# EAGLE design ESC_BOARD (EAGLE 9.1.3)
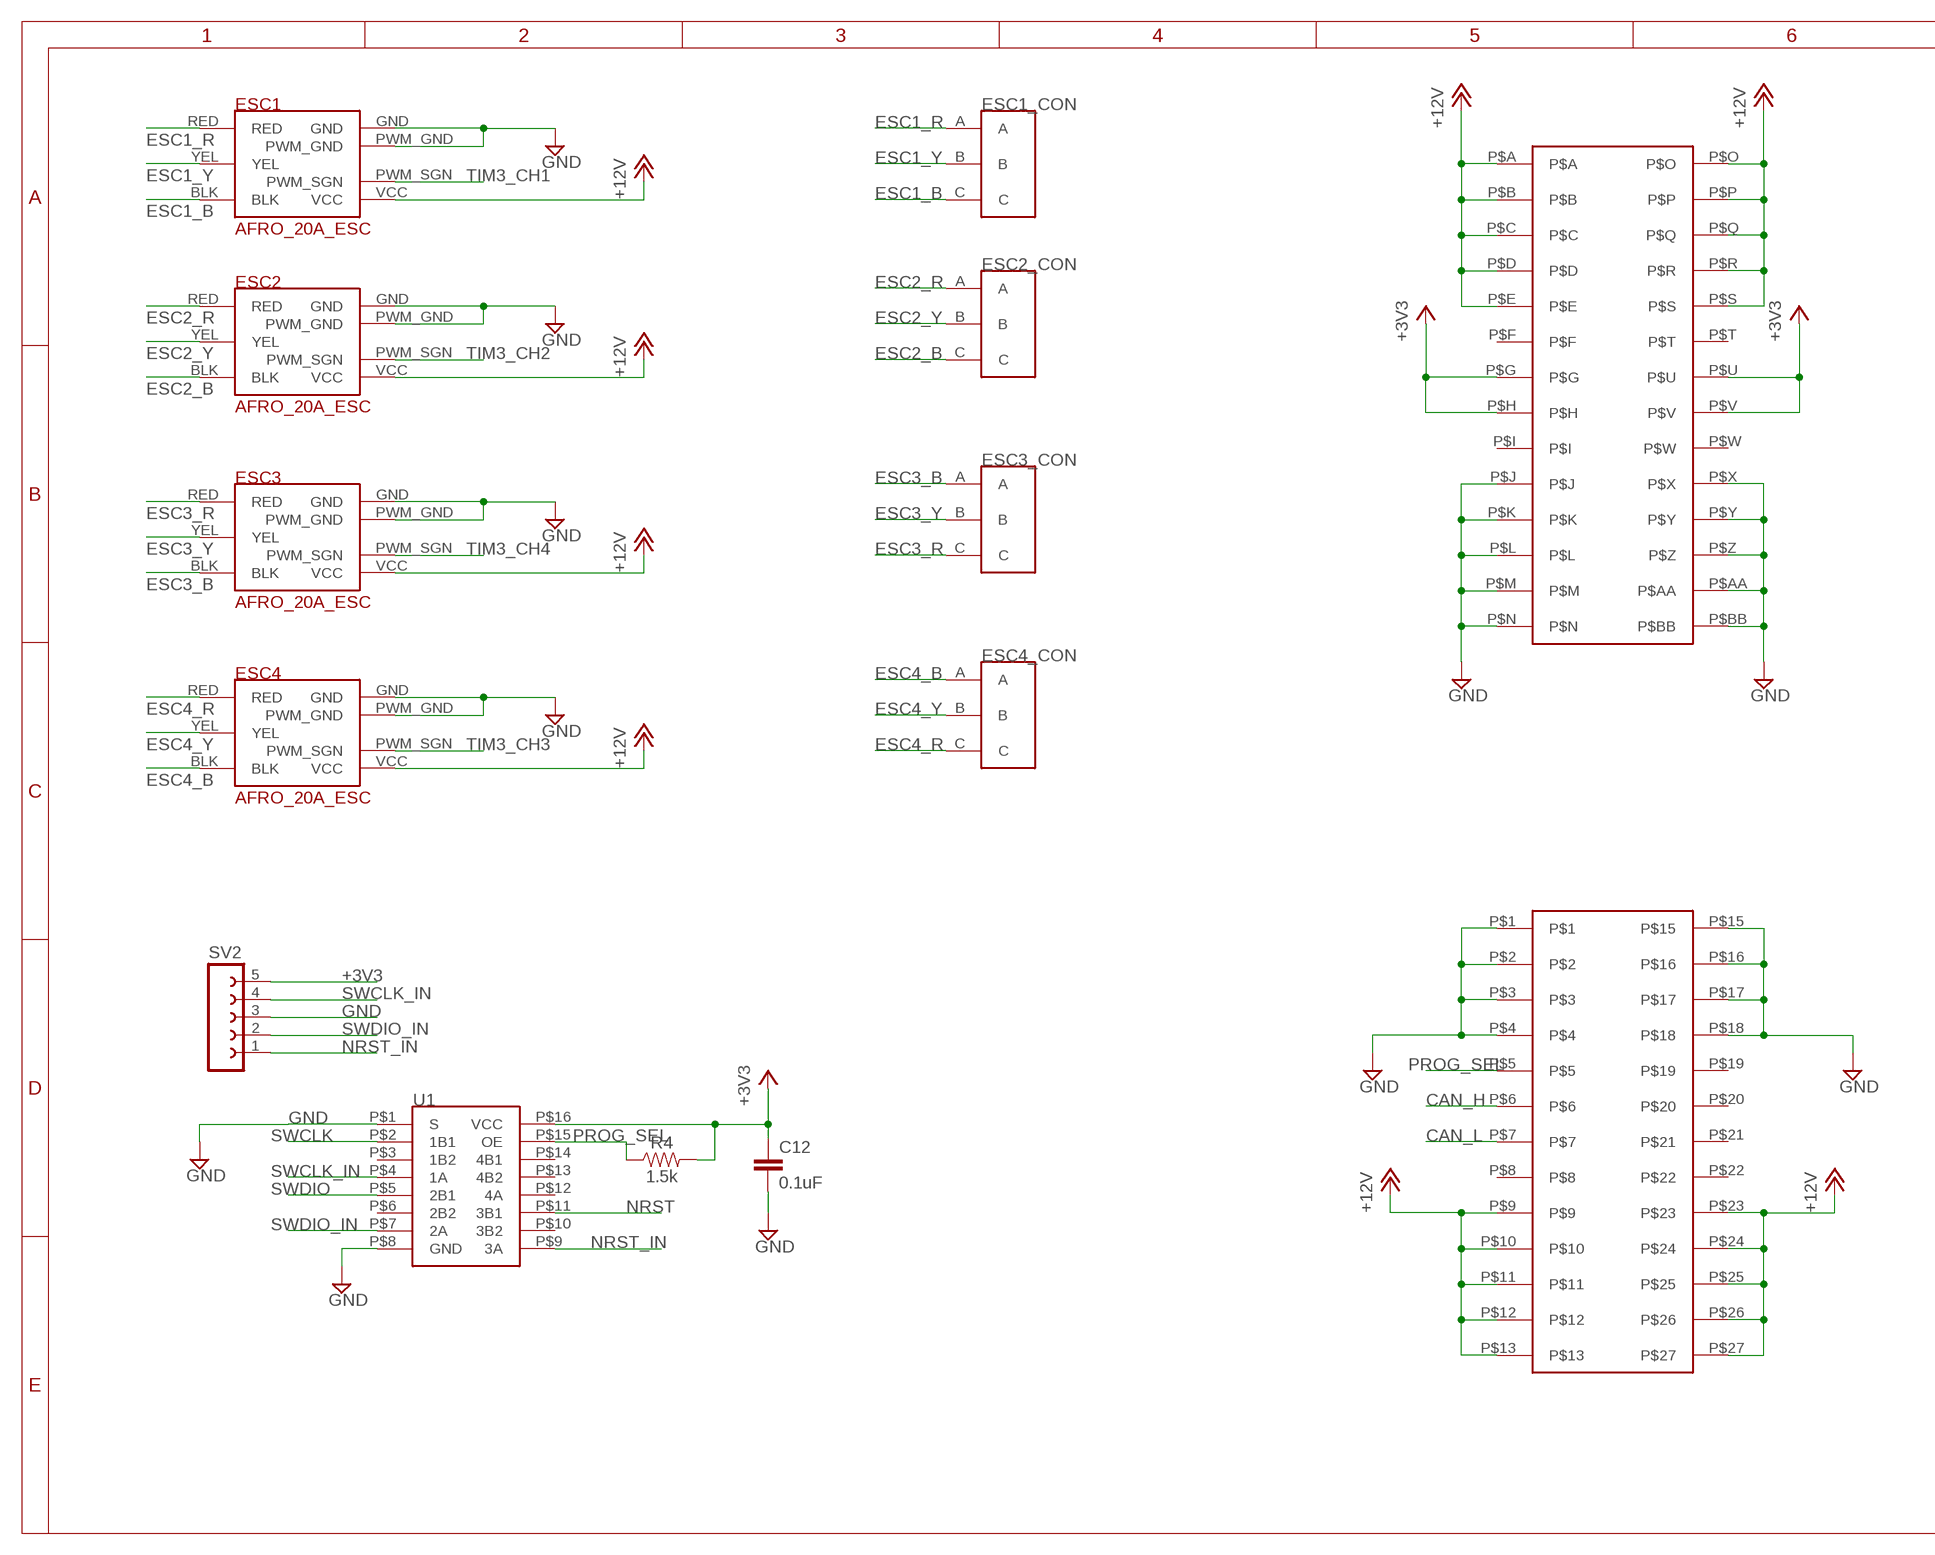
[diagram p0: schematic, sheet 1, part 1 of 2]
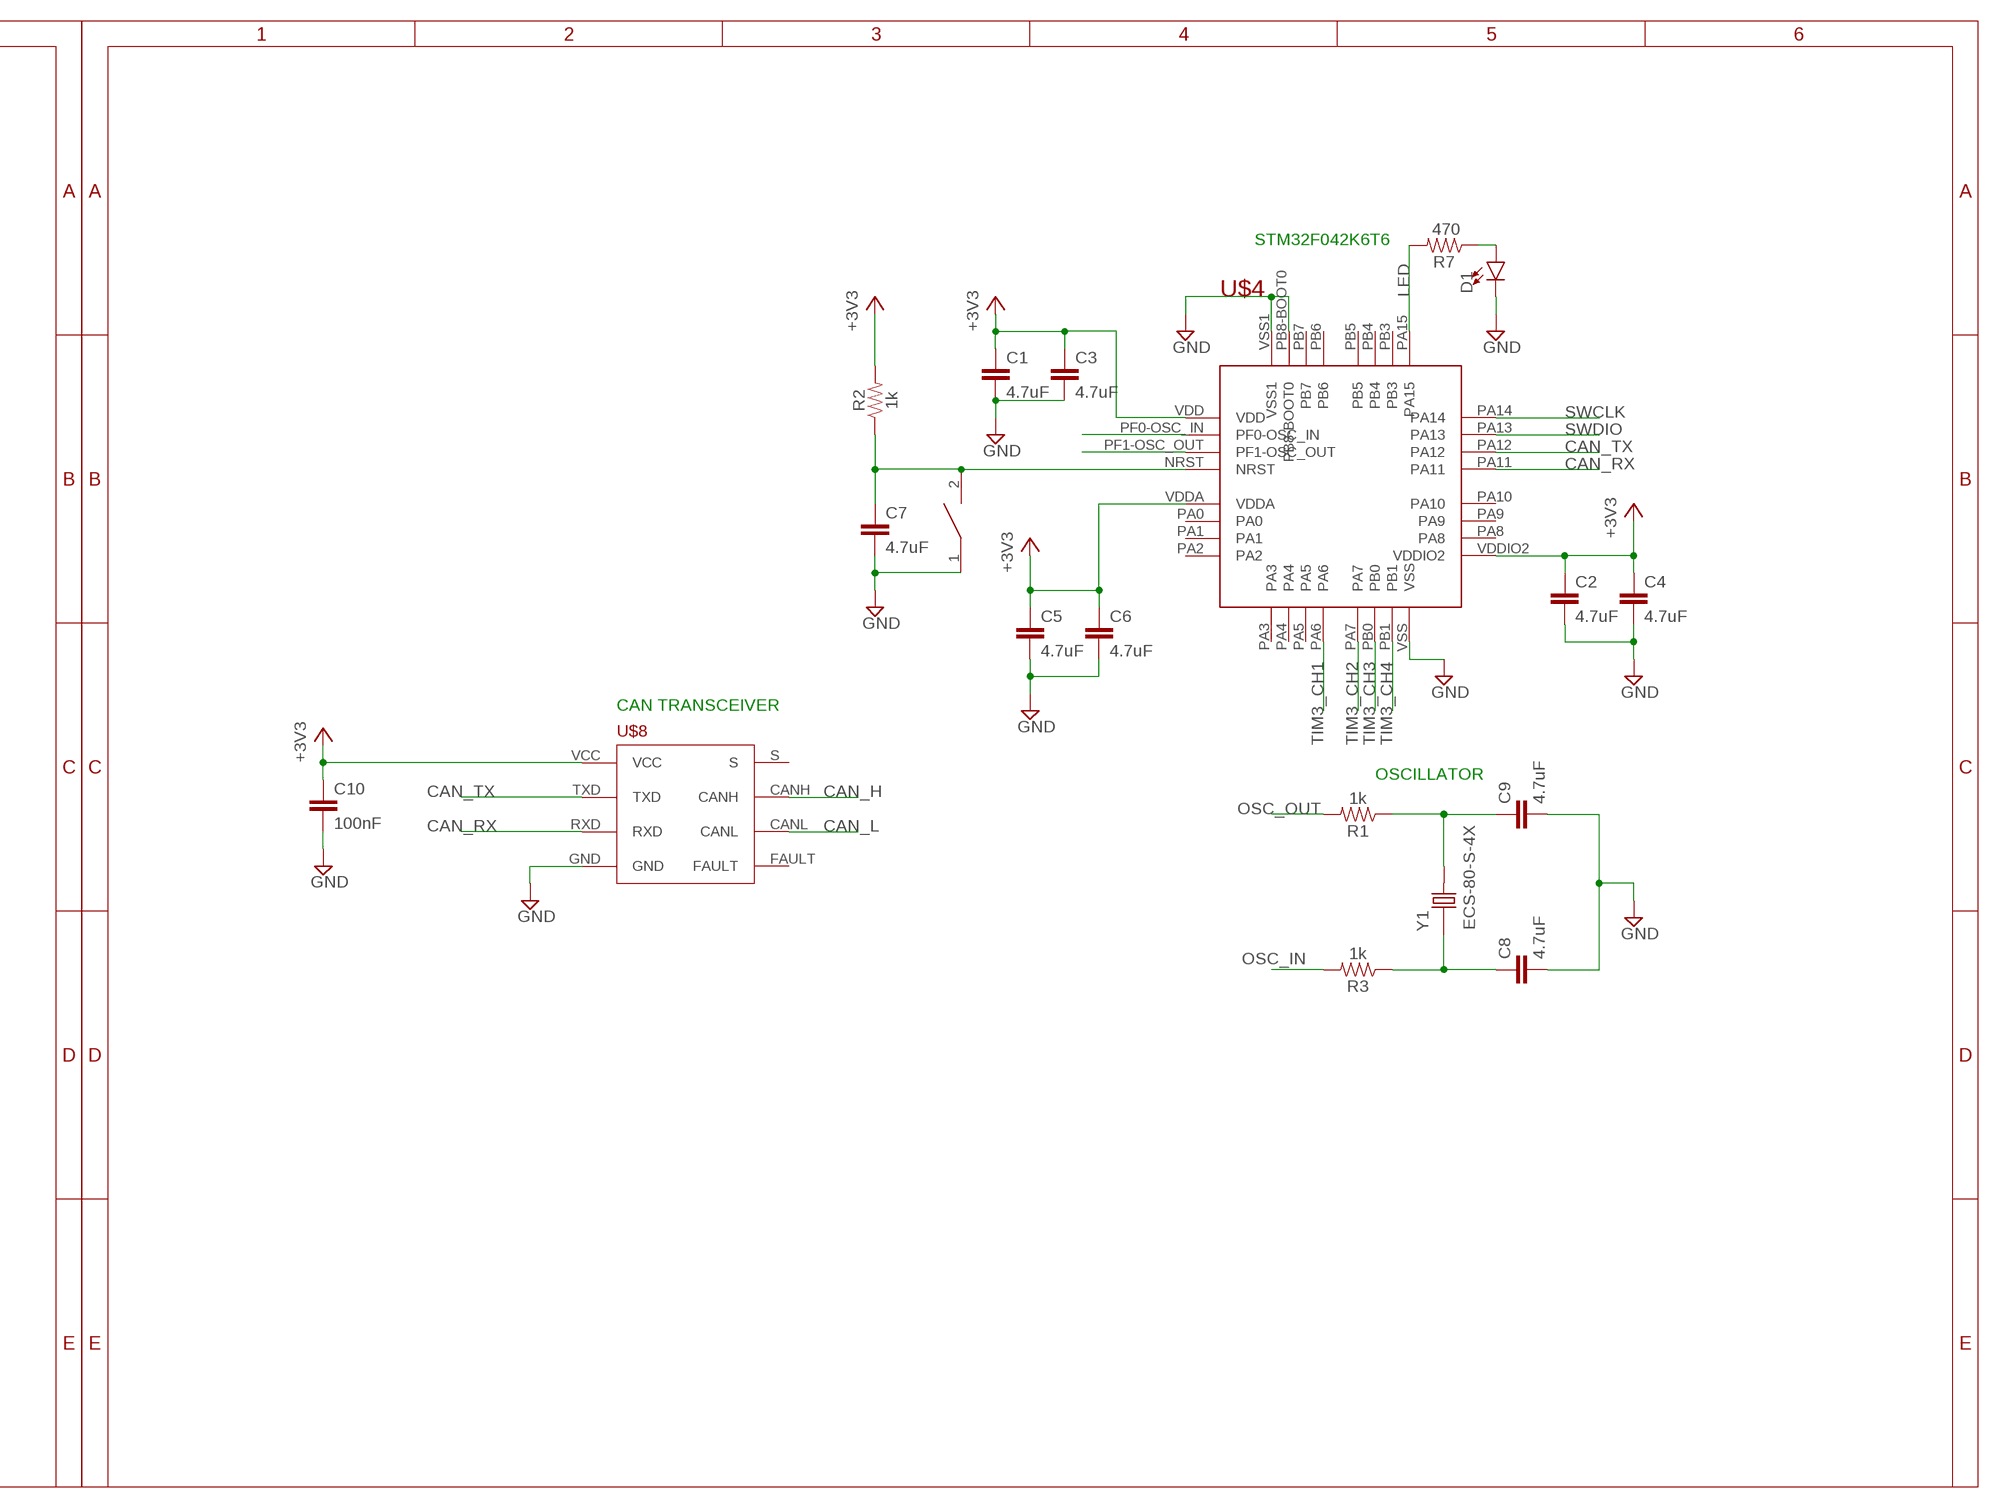
[diagram p1: schematic, sheet 1, part 2 of 2]

## Parts
C1  4.7uF  4.7UF0603  [0603]
C2  4.7uF  4.7UF0603  [0603]
C3  4.7uF  4.7UF0603  [0603]
C4  4.7uF  4.7UF0603  [0603]
C5  4.7uF  4.7UF0603  [0603]
C6  4.7uF  4.7UF0603  [0603]
C7  4.7uF  4.7UF0603  [0603]
C8  4.7uF  4.7UF0603  [0603]
C9  4.7uF  4.7UF0603  [0603]
C10  100nF  4.7UF0603  [0603]
C12  0.1uF  0.1UF-0603-25V-(+80/-20%)  [0603]
D1  LED0603  [LED-0603]
ESC1  AFRO_20A_ESC  [AFRO_20A_ESC]
ESC1_CON  3PINCONNECTOR  [3PINCONNECTOR]
ESC2  AFRO_20A_ESC  [AFRO_20A_ESC]
ESC2_CON  3PINCONNECTOR  [3PINCONNECTOR]
ESC3  AFRO_20A_ESC  [AFRO_20A_ESC]
ESC3_CON  3PINCONNECTOR  [3PINCONNECTOR]
ESC4  AFRO_20A_ESC  [AFRO_20A_ESC]
ESC4_CON  3PINCONNECTOR  [3PINCONNECTOR]
R1  1k  1KOHM-0603-1/10W-1%  [0603]
R2  1k  1KOHM-0603-1/10W-1%  [0603]
R3  1k  1KOHM-0603-1/10W-1%  [0603]
R4  1.5k  1.5KOHM-0603-1/10W-1%  [0603]
R7  470  RESISTOR0603  [0603]
RESET  SWITCH  [SW_2512]
SV2  FE05-1  [FE05-1]
U1  SN74CBTLV3257PWR  [SN74CBTLV3257PWR]
U$1  ESC2BACKPLANE  [ESC2BACKPLANE_WHOLE]
U$4  STM32F042K6T6  [STM32F042K6T6]
U$8  TCAN337D  [TCAN337D]
Y1  ECS-80-S-4X  [XTAL_ECS-80-S-4X]

## Nets
+3V3: C1.1 C2.1 C3.1 C4.1 C5.1 C6.1 C10.1 C12.1 R2.2 R4.2 SV2.5 U1.P$16(VCC) U$1.P$G U$1.P$H U$1.P$U U$1.P$V U$4.VDD U$4.VDDA U$4.VDDIO2 U$8.VCC
+12V: ESC1.VCC ESC2.VCC ESC3.VCC ESC4.VCC U$1.P$9 U$1.P$10 U$1.P$11 U$1.P$12 U$1.P$13 U$1.P$23 U$1.P$24 U$1.P$25 U$1.P$26 U$1.P$27 U$1.P$A U$1.P$B U$1.P$C U$1.P$D U$1.P$E U$1.P$O U$1.P$P U$1.P$Q U$1.P$R U$1.P$S
CAN_H: U$1.P$6 U$8.CANH
CAN_L: U$1.P$7 U$8.CANL
CAN_RX: U$4.PA11 U$8.RXD
CAN_TX: U$4.PA12 U$8.TXD
ESC1_B: ESC1.BLK ESC1_CON.C
ESC1_R: ESC1.RED ESC1_CON.A
ESC1_Y: ESC1.YEL ESC1_CON.B
ESC2_B: ESC2.BLK ESC2_CON.C
ESC2_R: ESC2.RED ESC2_CON.A
ESC2_Y: ESC2.YEL ESC2_CON.B
ESC3_B: ESC3.BLK ESC3_CON.A
ESC3_R: ESC3.RED ESC3_CON.C
ESC3_Y: ESC3.YEL ESC3_CON.B
ESC4_B: ESC4.BLK ESC4_CON.A
ESC4_R: ESC4.RED ESC4_CON.C
ESC4_Y: ESC4.YEL ESC4_CON.B
GND: C1.2 C2.2 C3.2 C4.2 C5.2 C6.2 C7.2 C8.2 C9.2 C10.2 C12.2 D1.C ESC1.GND ESC1.PWM_GND ESC2.GND ESC2.PWM_GND ESC3.GND ESC3.PWM_GND ESC4.GND ESC4.PWM_GND RESET.1 SV2.3 U1.P$1(S) U1.P$8(GND) U$1.P$1 U$1.P$2 U$1.P$3 U$1.P$4 U$1.P$15 U$1.P$16 U$1.P$17 U$1.P$18 U$1.P$AA U$1.P$BB U$1.P$J U$1.P$K U$1.P$L U$1.P$M U$1.P$N U$1.P$X U$1.P$Y U$1.P$Z U$4.PB8-BOOT0 U$4.VSS U$4.VSS1 U$8.GND
LED: R7.2 U$4.PA15
N$1: C9.1 R1.1 Y1.2
N$2: C8.1 R3.1 Y1.1
N$24: D1.A R7.1
NRST: C7.1 R2.1 RESET.2 U1.P$11(3B1) U$4.NRST
NRST_IN: SV2.1 U1.P$9(3A)
OSC_IN: R3.2 U$4.PF0-OSC_IN
OSC_OUT: R1.2 U$4.PF1-OSC_OUT
PROG_SEL: R4.1 U1.P$15(OE) U$1.P$5
SWCLK: U1.P$2(1B1) U$4.PA14
SWCLK_IN: SV2.4 U1.P$4(1A)
SWDIO: U1.P$5(2B1) U$4.PA13
SWDIO_IN: SV2.2 U1.P$7(2A)
TIM3_CH1: ESC1.PWM_SGN U$4.PA6
TIM3_CH2: ESC2.PWM_SGN U$4.PA7
TIM3_CH3: ESC4.PWM_SGN U$4.PB0
TIM3_CH4: ESC3.PWM_SGN U$4.PB1
Unconnected: U1.P$3(1B2) U1.P$6(2B2) U1.P$10(3B2) U1.P$12(4A) U1.P$13(4B2) U1.P$14(4B1) U$1.P$8 U$1.P$19 U$1.P$20 U$1.P$21 U$1.P$22 U$1.P$F U$1.P$I U$1.P$T U$1.P$W U$4.PA0 U$4.PA1 U$4.PA2 U$4.PA3 U$4.PA4 U$4.PA5 U$4.PA8 U$4.PA9 U$4.PA10 U$4.PB3 U$4.PB4 U$4.PB5 U$4.PB6 U$4.PB7 U$8.FAULT U$8.S

## Notes on the sheet
- STM32F042K6T6
- CAN TRANSCEIVER
- OSCILLATOR

## Library data of the parts
C1-C9 = SparkFun-Capacitors:4.7UF: 4.7µF ceramic capacitors A capacitor is a passive two-terminal electrical component used to store electrical energy temporarily in an electric field.; PROD_ID: CAP-08280
C10 = SparkFun-Capacitors:4.7UF: 4.7µF ceramic capacitors A capacitor is a passive two-terminal electrical component used to store electrical energy temporarily in an electric field.; PROD_ID: CAP-08280; VALUE: 4.7uF
C12 = SparkFun-Capacitors:0.1UF: 0.1µF ceramic capacitors A capacitor is a passive two-terminal electrical component used to store electrical energy temporarily in an electric field.; PROD_ID: CAP-00810
D1 = SparkFun-LED:LED: LED (Generic) Standard schematic elements and footprints for 5mm, 3mm, 1206, and 0603 sized LEDs. Generic LEDs with no color specified.
ESC1-ESC4 = afro_20A_esc:AFRO_20A_ESC
ESC1_CON ESC2_CON ESC3_CON ESC4_CON = afro_20A_esc:3PINCONNECTOR
R1-R3 = SparkFun-Resistors:1KOHM: 1kΩ resistor A resistor is a passive two-terminal electrical component that implements electrical resistance as a circuit element. Resistors act to reduce current flow, and, at the same time, act to lower voltage levels within circuits. - Wikipedia; PROD_ID: RES-07856
R4 = SparkFun-Resistors:1.5KOHM: 1.5kΩ resistor A resistor is a passive two-terminal electrical component that implements electrical resistance as a circuit element. Resistors act to reduce current flow, and, at the same time, act to lower voltage levels within circuits. - Wikipedia; PROD_ID: RES-08306
R7 = SparkFun-Resistors:RESISTOR: Generic Resistor Package
RESET = DiscreteComponents:SWITCH
SV2 = con-lsta:FE05-1: FEMALE HEADER; OC_FARNELL: unknown; OC_NEWARK: unknown
U1 = SN74CBTLV3257PWR:SN74CBTLV3257PWR
U$1 = ESC_to_Backplane_Connectors:ESC2BACKPLANE
U$4 = PI_Shield_Library:STM32F042K6T6
U$8 = PI_Shield_Library:TCAN337D
Y1 = ECS-80-S-4X:ECS-80-S-4X: CRYSTAL T/H; DESCRIPTION: Crystal 8MHz Series 2-Pin HC-49/U; DIGI-KEY_PART_NUMBER: X1057-ND; DIGI-KEY_PURCHASE_URL: https://www.digikey.com/product-detail/en/ecs-inc/ECS-80-S-4X/X1057-ND/827549?utm_source=snapeda&utm_medium=aggregator&utm_campaign=symbol; MF: ECS International; MP: ECS-80-S-4X; PACKAGE: HC-49/US ECS International

## Board
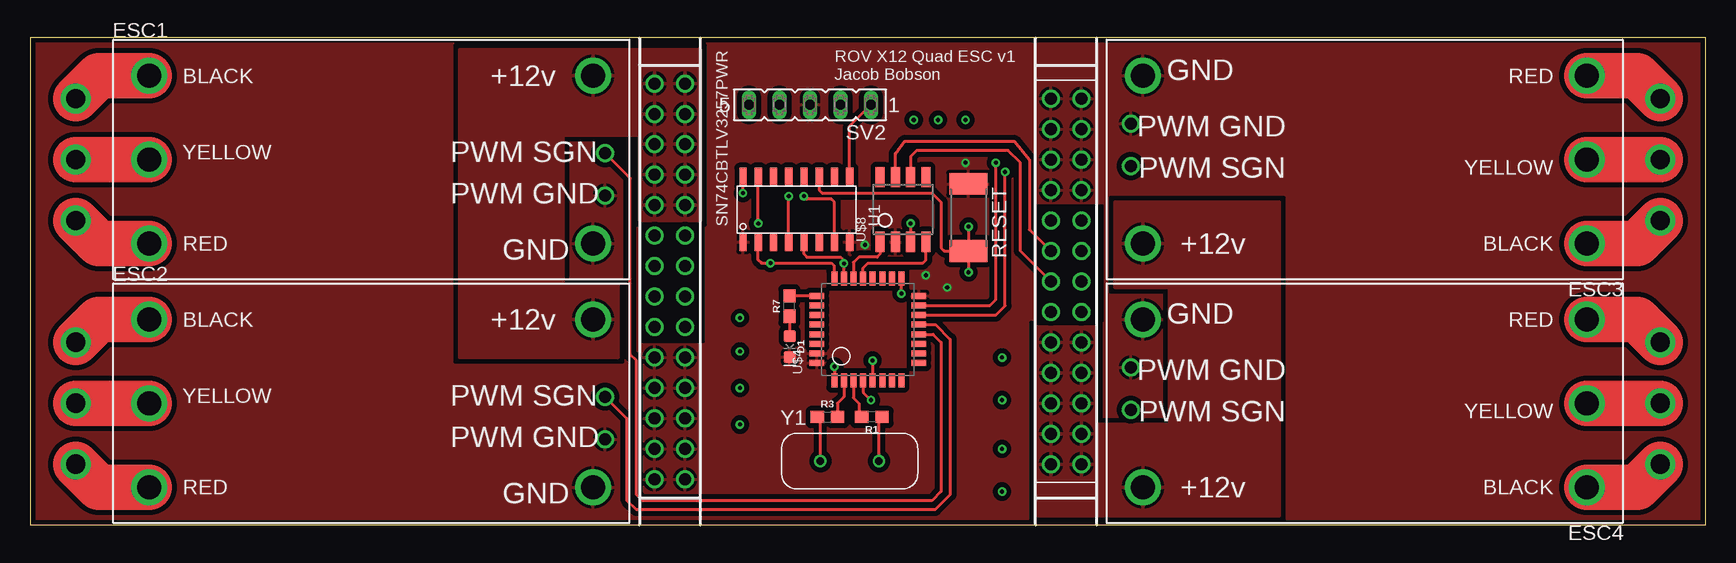
[diagram p2: board, top side]
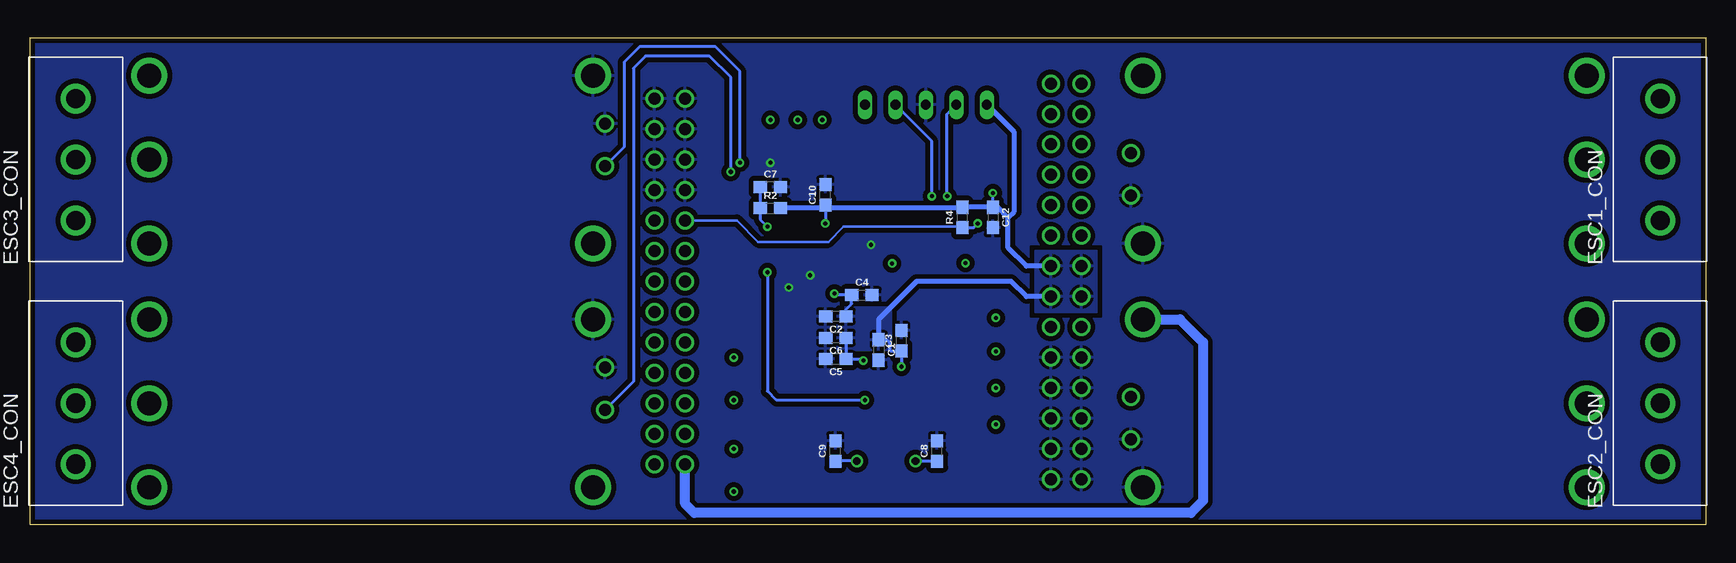
[diagram p3: board, bottom side, seen from below]

Size 139.68 x 40.64 mm. Coordinates in mm from the lower left corner, seen from the top.
Outline: 0,0 139.68,0 139.68,40.64 0,40.64 0,0
Copper layers (1*16): Top 0.0356mm / dielectric 1.5011mm / Bottom 0.0356mm
Design rules "ECE_Senior_Design": minimum track width 8mil, minimum drill 13mil, track to track 8mil, track to pad 8mil, pad to pad 6mil, via to via 8mil, smd to smd 6mil, copper to edge 15mil, drill to drill 8mil, minimum pad ring 7mil, minimum via ring 7mil, stop-mask expansion 3mil, vias tented up to drill 0mil, thermal gap 10mil

### Footprints (pad centres in the part's own frame; a part is rotated, then mirrored left to right if it is on the bottom)
0603 = smd 1.1 x 1: 1 -0.85,0; 2 0.85,0
LED-0603 = smd 1 x 1: A -0.877,0; C 0.877,0
AFRO_20A_ESC = drill 2: BLK -18,7; GND 19,-7; RED -18,-7; VCC 19,7; YEL -18,0 | drill 1: PWM_GND 20,-3; PWM_SGN 20,0.54
3PINCONNECTOR = drill 1.6 pad 2.5: A -5.08,0; B 0,0; C 5.08,0
SW_2512 = smd 1.8 x 3.2: 1 -2.8,0; 2 2.8,0
FE05-1 = drill 0.813 long: 1 -5.08,0; 2 -2.54,0; 3 0,0; 4 2.54,0; 5 5.08,0
SN74CBTLV3257PWR = smd 1.55 x 0.6: P$1 0,0; P$2 0,-1.27; P$3 0,-2.54; P$4 0,-3.81; P$5 0,-5.08; P$6 0,-6.35; P$7 0,-7.62; P$8 0,-8.89; P$9 5.4,-8.89; P$10 5.4,-7.62; P$11 5.4,-6.35; P$12 5.4,-5.08; P$13 5.4,-3.81; P$14 5.4,-2.54; P$15 5.4,-1.27; P$16 5.4,0
ESC2BACKPLANE_WHOLE = drill 1: P$1 1.27,31.75; P$2 3.81,31.75; P$3 6.35,31.75; P$4 8.89,31.75; P$5 11.43,31.75; P$6 13.97,31.75; P$7 16.51,31.75; P$8 19.05,31.75; P$9 21.59,31.75; P$10 24.13,31.75; P$11 26.67,31.75; P$12 29.21,31.75; P$13 31.75,31.75; P$15 1.27,34.29; P$16 3.81,34.29; P$17 6.35,34.29; P$18 8.89,34.29; P$19 11.43,34.29; P$20 13.97,34.29; P$21 16.51,34.29; P$22 19.05,34.29; P$23 21.59,34.29; P$24 24.13,34.29; P$25 26.67,34.29; P$26 29.21,34.29; P$27 31.75,34.29; P$A 0,-1.27; P$AA 30.48,1.27; P$B 2.54,-1.27; P$BB 33.02,1.27; P$C 5.08,-1.27; P$D 7.62,-1.27; P$E 10.16,-1.27; P$F 12.7,-1.27; P$G 15.24,-1.27; P$H 17.78,-1.27; P$I 20.32,-1.27; P$J 22.86,-1.27; P$K 25.4,-1.27; P$L 27.94,-1.27; P$M 30.48,-1.27; P$N 33.02,-1.27; P$O 0,1.27; P$P 2.54,1.27; P$Q 5.08,1.27; P$R 7.62,1.27; P$S 10.16,1.27; P$T 12.7,1.27; P$U 15.24,1.27; P$V 17.78,1.27; P$W 20.32,1.27; P$X 22.86,1.27; P$Y 25.4,1.27; P$Z 27.94,1.27
STM32F042K6T6 = smd 1.2 x 0.5: NRST 0,3.2; PA0 0,1.6; PA1 0,0.8; PA2 0,0; PA8 8.5,0.8; PA9 8.5,1.6; PA10 8.5,2.4; PA11 8.5,3.2; PA12 8.5,4; PA13 8.5,4.8; PA14 8.5,5.6; PF0-OSC_IN 0,4.8; PF1-OSC_OUT 0,4; VDD 0,5.6; VDDA 0,2.4; VDDIO2 8.5,0 | smd 0.5 x 1.2: PA3 1.45,-1.45; PA4 2.25,-1.45; PA5 3.05,-1.45; PA6 3.85,-1.45; PA7 4.65,-1.45; PA15 7.05,7.05; PB0 5.45,-1.45; PB1 6.25,-1.45; PB3 6.25,7.05; PB4 5.45,7.05; PB5 4.65,7.05; PB6 3.85,7.05; PB7 3.05,7.05; PB8-BOOT0 2.25,7.05; VSS 7.05,-1.45; VSS1 1.45,7.05
TCAN337D = smd 1.7 x 0.75: CANH 5.4,2.54; CANL 5.4,1.27; FAULT 5.4,0; GND 0,2.54; RXD 0,0; S 5.4,3.81; TXD 0,3.81; VCC 0,1.27
XTAL_ECS-80-S-4X = drill 0.63 pad 1.03: 1 -2.44,0; 2 2.44,0

### Placement (x,y rotation side)
C1  68.96,14.61 270 bottom
C2  72.52,17.4 180 bottom
C3  67.06,15.37 90 bottom
C4  70.36,19.18 0 bottom
C5  72.52,13.84 180 bottom
C6  72.52,15.62 180 bottom
C7  77.98,28.19 0 bottom
C8  64.08,6.17 90 bottom
C9  72.57,6.17 90 bottom
C10  73.41,27.53 90 bottom
C12  59.44,25.65 270 bottom
D1  63.32,14.88 270 top
ESC1  27.94,30.48 0 top
ESC1_CON  3.81,30.48 90 bottom
ESC2  27.94,10.16 0 top
ESC2_CON  3.81,10.16 90 bottom
ESC3  111.76,30.48 180 top
ESC3_CON  135.89,30.48 90 bottom
ESC4  111.76,10.16 180 top
ESC4_CON  135.89,10.16 90 bottom
R1  70.18,9.02 180 top
R2  77.98,26.42 0 bottom
R3  66.47,9.02 0 top
R4  61.98,25.65 90 bottom
R7  63.3,18.26 90 top
RESET  78.23,25.65 270 top
SV2  65.02,35.05 180 top
U1  59.44,23.62 90 top
U$1  53.34,36.83 270 top
U$4  72.64,12.06 90 top
U$8  74.68,23.62 90 top
Y1  68.33,5.33 0 top

### Tracks (layer width: path | path; a pad name or v marks a point on that pad's centre or on a via)
+3V3  (via drill 0.35)
  Top 0.254: v72.64,19.3 U$4.VDDIO2 | v67.06,13.21 67.06,12.08 U$4.VDD | v70.23,13.72 70.24,13.7 U$4.VDDA | v59.44,27.69 U1.P$16 | v73.41,25.15 U$8.VCC
  Bottom 0.254: v72.64,19.3 72.52,19.18 C4.1 71.21,18.45 71.67,18 C2.1 | v67.06,13.21 C3.1 67.91,14.52 67.94,14.48 68.07,14.61 68.07,15.24 68.29,15.46 C1.1 | v70.23,13.72 70.36,13.84 C5.1 C6.1 | C12.1 v59.44,27.69 | C10.1 73.41,26.42 v73.41,25.15
  Bottom 0.406: U$1.P$U 56.64,21.59 58.17,23.11 58.17,25.65 | 58.17,25.65 59.02,26.5 C12.1 R4.2 62.06,26.42 73.41,26.42 | 58.17,25.65 57.66,26.16 57.66,32.77 SV2.5 | C10.1 73.67,26.42 R2.2 | C1.1 68.96,17.14 65.79,20.32 57.91,20.32 56.64,19.05 U$1.P$V
  pour Bottom: 72.39,18.16 72.39,14.61 67.94,14.61 67.94,18.16
  pour Bottom: 50.8,22.86 55.88,22.86 55.88,17.78 50.8,17.78
+12V
  Bottom 0.813: ESC2.VCC 43.83,17.16 41.91,15.24 41.91,2.03 42.93,1.02 84.33,1.02 85.09,1.78 U$1.P$13
  pour Top (isolate 0.406, rank 2): 55.88,25.4 50.8,25.4 50.8,38.35 55.88,38.35
  pour Top (isolate 0.406, rank 2): 83.82,3.56 83.82,16.51 88.9,16.51 88.9,3.56
  pour Top (isolate 0.406, rank 2): 43.43,39.62 43.43,32.51 55.88,32.51 55.88,39.62
  pour Top (isolate 0.406, rank 2): 44.45,39.62 35.81,39.62 35.81,13.97 49.02,13.97 49.02,20.07 44.45,20.07
  pour Top (isolate 0.406, rank 2): 83.82,8.38 83.82,0.76 104.14,0.76 104.14,8.38
  pour Top (isolate 0.406, rank 2): 104.14,8.38 104.14,26.92 90.42,26.92 90.42,19.81 95,19.81 95,8.38
CAN_H
  Top 0.254: U$8.CANH 72.14,30.99 72.9,32 82.04,32 83.31,30.48 83.31,24.64 U$1.P$6
CAN_L
  Top 0.254: U$1.P$7 82.55,22.86 82.55,30.23 81.53,31.24 73.91,31.24 73.41,30.73 U$8.CANL
CAN_RX
  Top 0.254: U$4.PA11 69.44,21.44 69.85,21.84 74.42,21.84 74.68,22.1 U$8.RXD
CAN_TX
  Top 0.254: U$8.TXD 70.87,22.61 70.61,22.35 69.09,22.35 68.64,21.91 U$4.PA12
ESC1_B
  Top 3.81: ESC1_CON.C 5.73,37.48 ESC1.BLK
ESC1_R
  Top 3.81: ESC1_CON.A 5.73,23.48 ESC1.RED
ESC1_Y
  Top 3.81: ESC1_CON.B ESC1.YEL
ESC2_B
  Top 3.81: ESC2.BLK 5.73,17.16 ESC2_CON.C
ESC2_R
  Top 3.81: ESC2.RED 5.73,3.16 ESC2_CON.A
ESC2_Y
  Top 3.81: ESC2.YEL ESC2_CON.B
ESC3_B
  Top 3.81: ESC3.BLK 133.97,23.48 ESC3_CON.A
ESC3_R
  Top 3.81: ESC3.RED 133.97,37.48 ESC3_CON.C
ESC3_Y
  Top 3.81: ESC3.YEL ESC3_CON.B
ESC4_B
  Top 3.81: ESC4.BLK 133.97,3.16 ESC4_CON.A
ESC4_R
  Top 3.81: ESC4.RED 133.97,17.16 ESC4_CON.C
ESC4_Y
  Top 3.81: ESC4.YEL ESC4_CON.B
GND  (via drill 0.35)
  other vias: 77.98,30.23 74.68,20.83 76.45,19.81 69.6,23.37
  pour Top (isolate 0.406, rank 3): -1.52,42.16 -1.52,-1.02 141.22,-1.02 141.22,42.16
  pour Bottom (isolate 0.406, rank 3): -0.51,41.66 -0.51,-1.52 142.24,-1.52 142.24,41.66
  cutout Top: 50.8,24.89 56.13,24.89 56.13,15.24 50.8,15.24
  cutout Top: 83.82,26.67 89.41,26.67 89.41,17.02 83.82,17.02
GND1  (via drill 0.35)
  other vias: 73.66,33.78
GND2  (via drill 0.35)
  other vias: 77.98,33.78
GND3  (via drill 0.35)
  other vias: 75.69,33.78
GND4  (via drill 0.35)
  other vias: 59.18,17.27
GND5  (via drill 0.35)
  other vias: 59.18,14.48
GND6  (via drill 0.35)
  other vias: 59.18,11.43
GND7  (via drill 0.35)
  other vias: 59.18,8.38
GND8  (via drill 0.35)
  other vias: 81.03,13.97
GND9  (via drill 0.35)
  other vias: 81.03,10.41
GND10  (via drill 0.35)
  other vias: 81.03,6.35
GND11  (via drill 0.35)
  other vias: 81.03,2.79
LED
  Top 0.254: U$4.PA15 R7.2
N$1
  Top 0.254: Y1.2 70.77,8.75 R1.1
  Bottom 0.254: Y1.2 72.56,5.33 C9.1
N$2
  Top 0.254: Y1.1 65.89,8.75 R3.1
  Bottom 0.254: C8.1 65.87,5.32 Y1.1
N$24
  Top 0.254: R7.1 63.3,15.79 D1.A
NRST  (via drill 0.35)
  Top 0.254: v78.23,24.89 RESET.2 | RESET.2 v78.23,21.08 | U1.P$11 65.79,27.94 66.04,27.69 75.18,27.69 75.95,26.92 75.95,23.11 76.2,22.86 RESET.2 | U$4.NRST 69.44,11.07 v70.1,10.41
  Bottom 0.254: C7.1 R2.1 78.83,25.49 v78.23,24.89 | v78.23,21.08 78.23,11.18 77.47,10.41 v70.1,10.41
NRST_IN
  Top 0.254: U1.P$9 68.33,33.27 SV2.1
OSC_IN
  Top 0.254: U$4.PF0-OSC_IN 67.84,10.69 67.31,10.16 R3.2
OSC_OUT
  Top 0.254: U$4.PF1-OSC_OUT 68.64,10.6 69.09,10.16 69.09,9.26 R1.2
PROG_SEL  (via drill 0.35)
  Top 0.254: v60.71,25.15 U1.P$15
  Bottom 0.203: U$1.P$5 80.77,25.4 78.99,23.62 73.15,23.62 71.88,24.89 62.06,24.89 R4.1
  Bottom 0.254: R4.1 61.05,24.8 v60.71,25.15
SWCLK  (via drill 0.35)
  Top 0.254: U$4.PA14 67.04,21.6 66.8,21.84 v61.72,21.84 60.96,21.84 60.71,22.1 U1.P$2
SWCLK_IN  (via drill 0.35)
  Top 0.254: U1.P$4 v63.25,27.43
  Bottom 0.254: v63.25,27.43 63.25,34.29 SV2.4
SWDIO  (via drill 0.35)
  Top 0.254: U$4.PA13 v67.84,21.82 67.84,22.07 67.56,22.35 64.77,22.35 64.52,22.61 U1.P$5
SWDIO_IN  (via drill 0.35)
  Top 0.254: U1.P$7 67.06,26.92 66.8,27.18 64.77,27.18 v64.52,27.43
  Bottom 0.254: v64.52,27.43 64.52,32 SV2.2
TIM3_CH1
  Top 0.254: U$4.PA6 75.27,15.91 75.95,15.24 75.95,2.79 75.18,2.03 51.05,2.03 50.55,2.54 50.55,13.72 50.04,14.22 50.04,28.92 ESC1.PWM_SGN
TIM3_CH2
  Top 0.254: U$4.PA7 75.49,16.71 76.71,15.49 76.71,2.54 75.44,1.27 50.55,1.27 49.78,2.03 49.78,8.86 ESC2.PWM_SGN
TIM3_CH3  (via drill 0.35)
  Top 0.254: U$4.PB0 80.51,17.52 81.28,18.29 v81.28,29.46
  Bottom 0.254: v81.28,29.46 81.28,37.34 83.06,39.12 88.39,39.12 89.41,38.1 89.41,11.97 ESC4.PWM_SGN
TIM3_CH4  (via drill 0.35)
  Top 0.254: U$4.PB1 80.04,18.32 80.52,18.8 v80.52,30.23
  Bottom 0.254: v80.52,30.23 80.52,37.85 82.55,39.88 88.9,39.88 90.17,38.61 90.17,31.53 ESC3.PWM_SGN

### Text on the board
tPlace: ROV X12 Quad ESC v1 / Jacob Bobson